# Altium schematic sheet Sheet.SchDoc
size A2
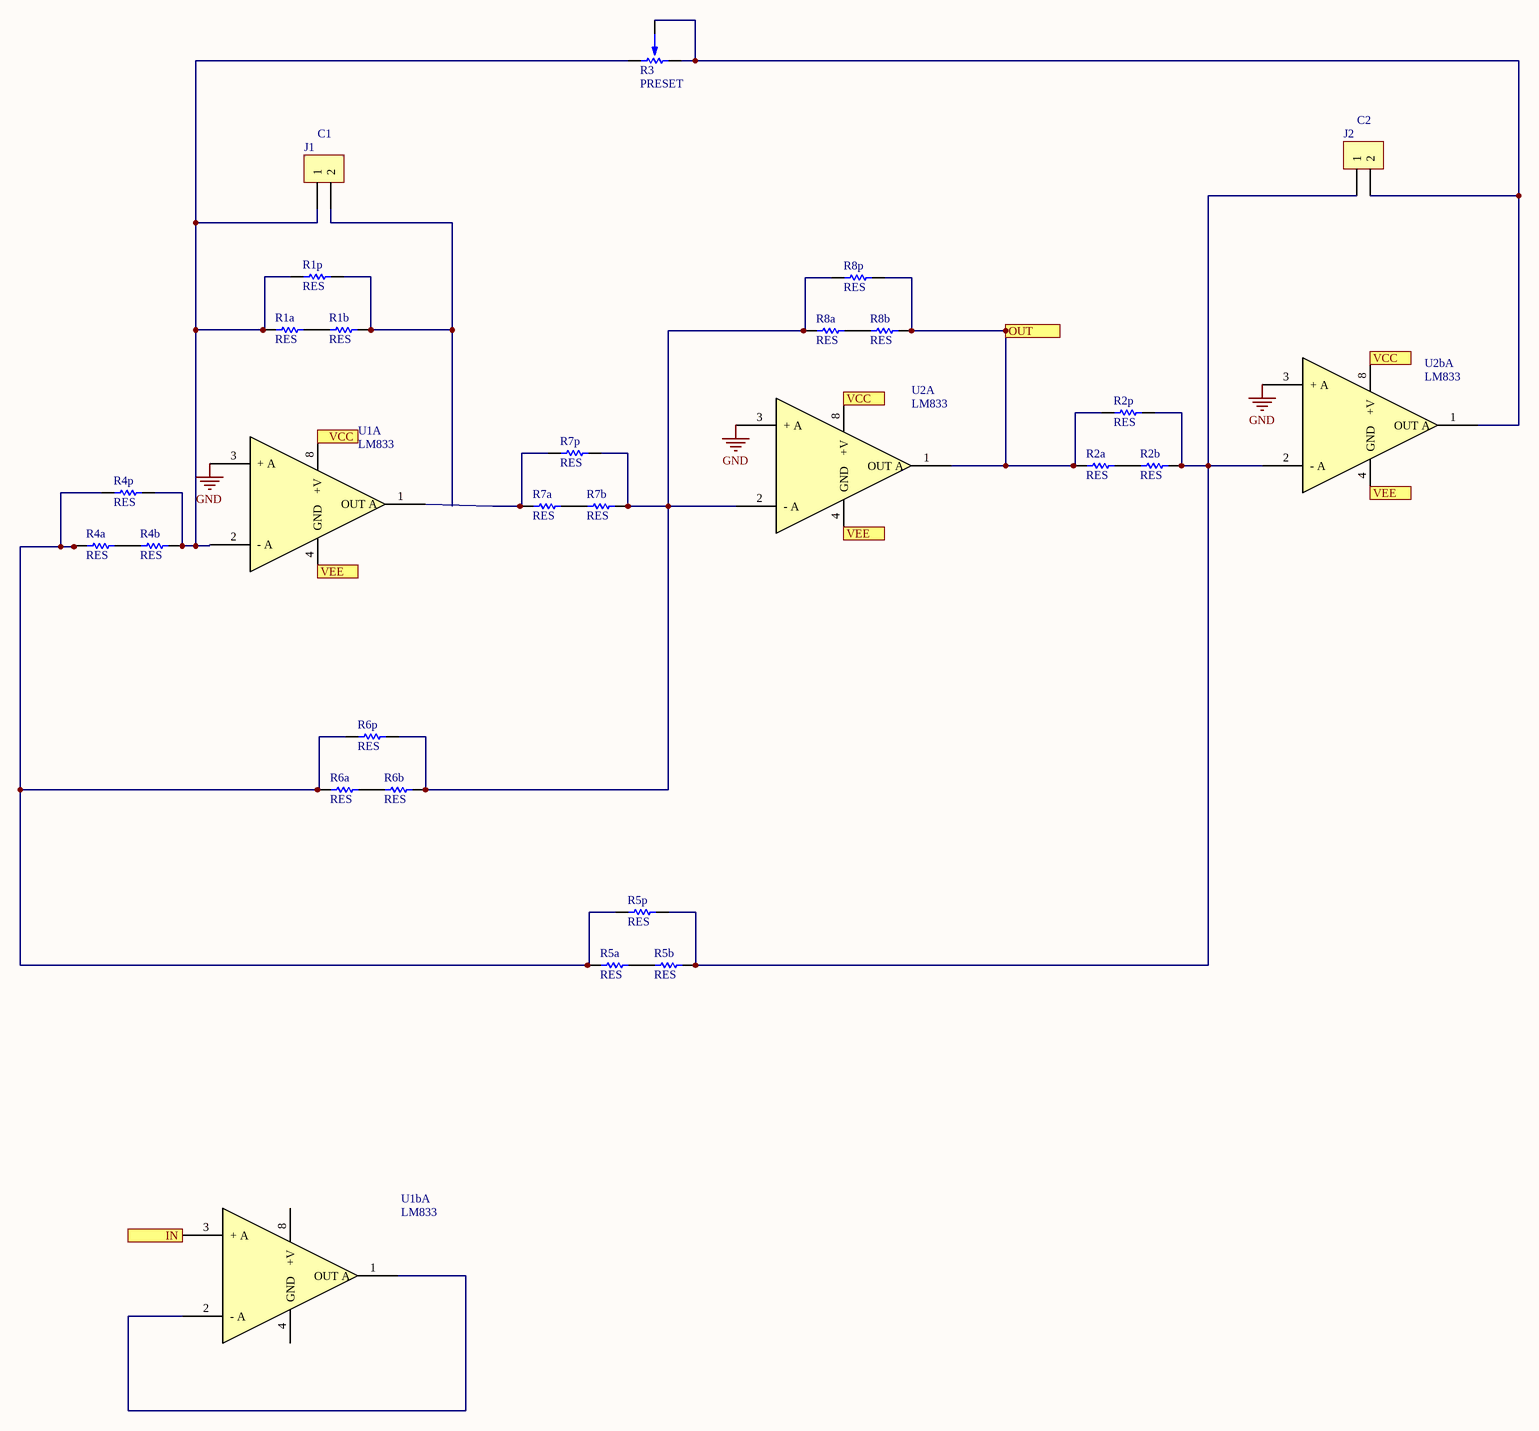
[diagram p0: Sheet.SchDoc]

## Parts
J1  C1  [SIP2]
J2  C2  [SIP2]
R1a  RES  [0805]
R1b  RES  [0805]
R1p  RES  [0805]
R2a  RES  [0805]
R2b  RES  [0805]
R2p  RES  [0805]
R3  PRESET  [PRESET H]
R4a  RES  [0805]
R4b  RES  [0805]
R4p  RES  [0805]
R5a  RES  [0805]
R5b  RES  [0805]
R5p  RES  [0805]
R6a  RES  [0805]
R6b  RES  [0805]
R6p  RES  [0805]
R7a  RES  [0805]
R7b  RES  [0805]
R7p  RES  [0805]
R8a  RES  [0805]
R8b  RES  [0805]
R8p  RES  [0805]
U1  LM833  [DIP8]  (part A of 2)
U1b  LM833  [DIP8]  (part A of 2)
U2  LM833  [DIP8]  (part A of 2)
U2b  LM833  [DIP8]  (part A of 2)

## Ports
IN (in), OUT, VCC, VEE

## Nets
GND: U1.3(+_A) U2.3(+_A) U2b.3(+_A)
IN: U1b.3(+_A) ; port IN
OUT: R2a.1 R2p.1 R8b.2 R8p.2 U2.1(OUT_A) ; port OUT
VCC: U1.8(+V) U2.8(+V) U2b.8(+V) ; port VCC
VEE: U1.4(GND) U2.4(GND) U2b.4(GND) ; port VEE
NetJ1_1: J1.1 R1a.1 R1p.1 R3.1 R4b.2 R4p.2 U1.2(-_A)
NetJ1_2: J1.2 R1b.2 R1p.2
NetJ2_1: J2.1 R2b.2 R2p.2 R5b.2 R5p.2 U2b.2(-_A)
NetJ2_2: J2.2 R3.2 R3.3 U2b.1(OUT_A)
NetR1a_2: R1a.2 R1b.1
NetR2a_2: R2a.2 R2b.1
NetR4a_1: R4a.1 R4p.1 R5a.1 R5p.1 R6a.1 R6p.1
NetR4a_2: R4a.2 R4b.1
NetR5a_2: R5a.2 R5b.1
NetR6a_2: R6a.2 R6b.1
NetR6b_2: R6b.2 R6p.2 R7b.2 R7p.2 R8a.1 R8p.1 U2.2(-_A)
NetR7a_1: R7a.1 R7p.1 U1.1(OUT_A)
NetR7a_2: R7a.2 R7b.1
NetR8a_2: R8a.2 R8b.1
NetU1b_1: U1b.1(OUT_A) U1b.2(-_A)

Not connected (* = marked no-connect by the designer): U1b 4(GND) 8(+V)

## Notes on the sheet
- Title
- Size:
- Date:
- File:
- A2
- Number:
- Time:
- Revision:
- Sheet
- of

## Library data of the parts
J1 J2 = CON2
U1 U1b U2 U2b = LM833: Dual Audio Operational Amplifier